# EAGLE design LS7366R_TestPRoject (EAGLE 7.5.0)
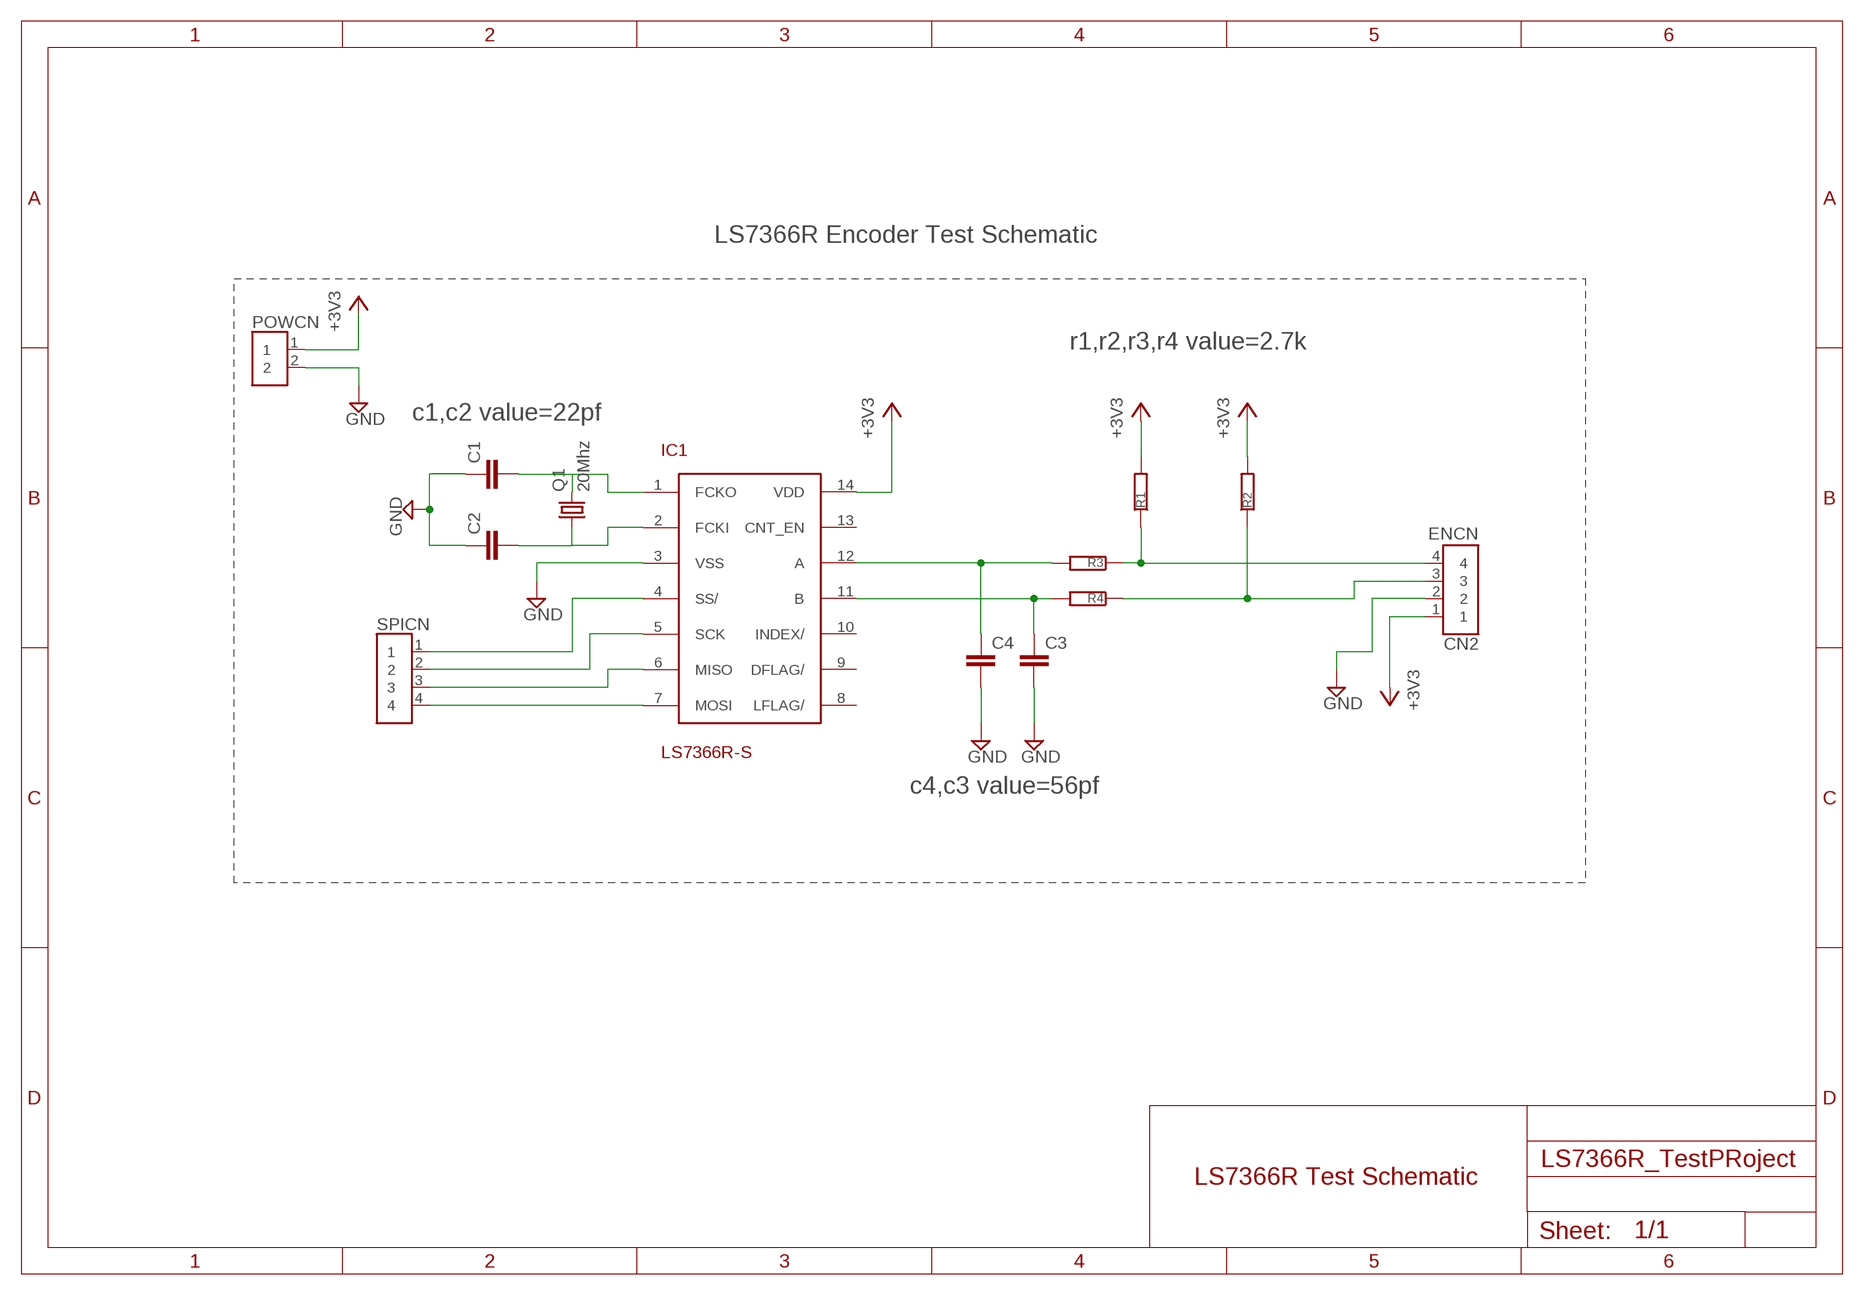
[diagram p0: schematic, sheet 1]

## Parts
C1  22pf  CHIP_CAPACITOR_0603  [L0_0603]
C2  22pf  CHIP_CAPACITOR_0603  [L0_0603]
C3  56pf  CHIP_CAPACITOR_0603  [L0_0603]
C4  56pf  CHIP_CAPACITOR_0603  [L0_0603]
CN2  ENCN  TUNIK-4PIN  [L0_TUNIK-4]
IC1  LS7366R-S  [SOIC-14]
POWCN  TUNIK-2PIN  [L0_TUNIK-2]
Q1  20Mhz  CRYSTAL_ABM3  [L0_ABM3]
R1  2.7k  CHIP_RESISTOR_0603  [L0_0603]
R2  2.7k  CHIP_RESISTOR_0603  [L0_0603]
R3  2.7k  CHIP_RESISTOR_0603  [L0_0603]
R4  2.7k  CHIP_RESISTOR_0603  [L0_0603]
SPICN  TUNIK-4PIN  [L0_TUNIK-4]

## Nets
+3V3: CN2.1 IC1.14(VDD) POWCN.1 R1.2 R2.2
GND: C1.2 C2.2 C3.1 C4.1 CN2.2 IC1.3(VSS) POWCN.2
N$1: CN2.4 R1.1 R3.1
N$2: CN2.3 R2.1 R4.1
N$3: C4.2 IC1.12(A) R3.2
N$4: C3.2 IC1.11(B) R4.2
N$5: C1.1 IC1.1(FCKO) Q1.2
N$6: C2.1 IC1.2(FCKI) Q1.1
N$9: IC1.4(SS/) SPICN.1
N$10: IC1.5(SCK) SPICN.2
N$11: IC1.6(MISO) SPICN.3
N$12: IC1.7(MOSI) SPICN.4
Unconnected: IC1.8(LFLAG/) IC1.9(DFLAG/) IC1.10(INDEX/) IC1.13(CNT_EN)

## Notes on the sheet
- LS7366R Encoder Test Schematic
- r1,r2,r3,r4 value=2.7k
- c1,c2 value=22pf
- c4,c3 value=56pf
- LS7366R Test Schematic

## Library data of the parts
C1-C4 = FINAL-JibPivot:CHIP_CAPACITOR: SMD Chip Capacitor
CN2 SPICN = FINAL-JibPivot:TUNIK-4PIN: TUNIK Connector
IC1 = smd-footprints:LS7366R-S
POWCN = 2axishead-Final:TUNIK-2PIN: TUNIK Connector
Q1 = FINAL-JibPivot:CRYSTAL_ABM3: SMD Crystal Miniature Ceramic SMD Crystal
R1-R4 = FINAL-JibPivot:CHIP_RESISTOR: SMD Chip Resistor

## Board
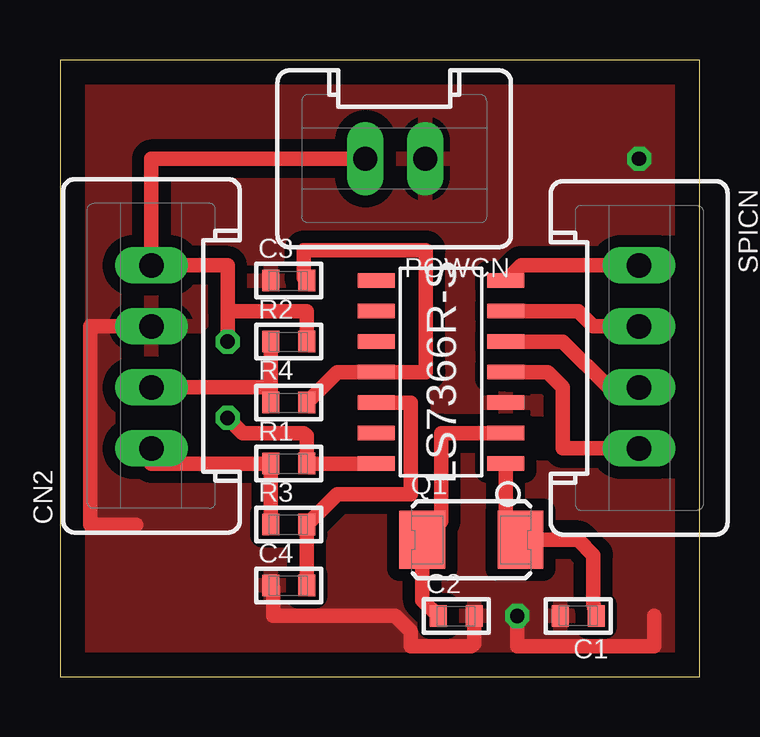
[diagram p1: board, top side]
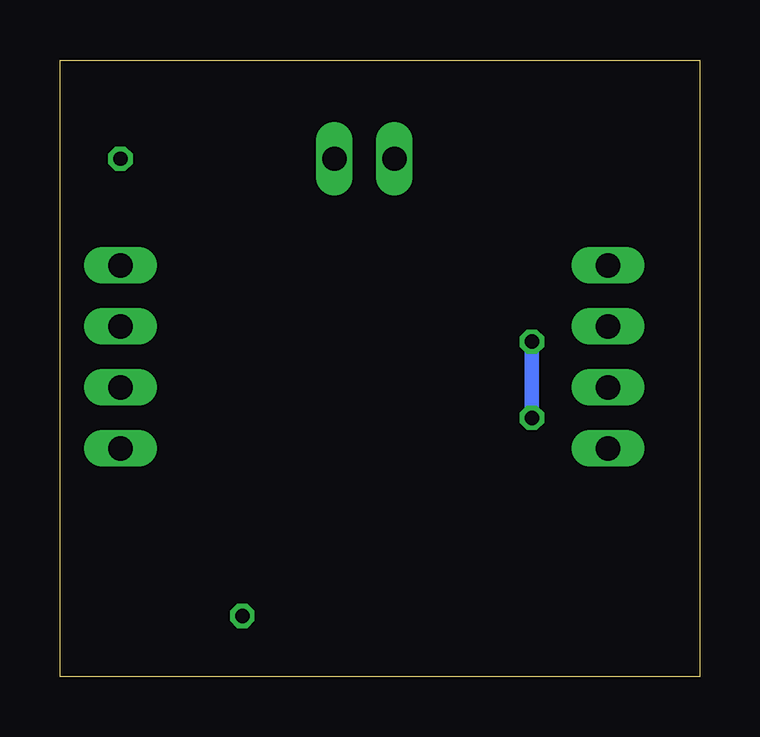
[diagram p2: board, bottom side, seen from below]

Size 26.65 x 25.71 mm. Coordinates in mm from the lower left corner, seen from the top.
Outline: 0,0 26.65,0 26.65,25.71 0,25.71 0,0
Copper layers (1*16): Top 0.035mm / dielectric 1.5mm / Bottom 0.035mm
Design rules "default": minimum track width 10mil, minimum drill 24mil, track to track 8mil, track to pad 8mil, pad to pad 8mil, via to via 8mil, smd to smd 8mil, copper to edge 40mil, drill to drill 8mil, minimum pad ring 10mil, minimum via ring 8mil, stop-mask expansion 4mil, vias tented up to drill 0mil, thermal gap 10mil

### Footprints (pad centres in the part's own frame; a part is rotated, then mirrored left to right if it is on the bottom)
L0_0603 = smd 0.7 x 0.9: 1 -0.75,0; 2 0.75,0
L0_TUNIK-4 = drill 1.016 long: 1 3.81,0; 2 1.27,0; 3 -1.27,0; 4 -3.81,0
SOIC-14 = smd 0.6 x 1.55: 1 -3.81,-2.7; 2 -2.54,-2.7; 3 -1.27,-2.7; 4 0,-2.7; 5 1.27,-2.7; 6 2.54,-2.7; 7 3.81,-2.7; 8 3.81,2.7; 9 2.54,2.7; 10 1.27,2.7; 11 0,2.7; 12 -1.27,2.7; 13 -2.54,2.7; 14 -3.81,2.7
L0_TUNIK-2 = drill 1.016 long: 1 1.25,0; 2 -1.25,0
L0_ABM3 = smd 1.9 x 2.4: 1 -2.05,0; 2 2.05,0

### Placement (x,y rotation side)
C1  21.59,2.54 180 top
C2  16.51,2.54 0 top
C3  9.53,16.51 0 top
C4  9.53,3.81 0 top
CN2  3.81,13.34 90 top
IC1  15.88,12.7 90 top
POWCN  13.97,21.59 180 top
Q1  17.14,5.71 0 top
R1  9.53,8.89 0 top
R2  9.53,13.97 0 top
R3  9.53,6.35 0 top
R4  9.53,11.43 0 top
SPICN  24.13,13.34 270 top

### Tracks (layer width: path | path; a pad name or v marks a point on that pad's centre or on a via)
+3V3  (via drill 0.6)
  Top 0.61: IC1.14 R1.2 10.27,10.04 10.16,10.16 7.62,10.16 v6.99,10.79 | R2.2 10.27,15.24 6.99,15.24 | 6.99,15.24 6.99,17.14 CN2.1 3.81,21.59 POWCN.1 | 6.99,15.24 v6.99,13.97
  Bottom 0.61: v6.99,10.79 v6.99,13.97
GND  (via drill 0.6)
  Top 0.61: CN2.2 1.27,14.61 1.27,6.35 3.17,6.35 | C4.1 8.89,3.69 8.89,2.54 13.97,2.54 14.6,1.9 14.6,1.27 17.14,1.27 17.26,1.38 C2.2 | v19.05,2.54 19.05,1.27 24.77,1.27 24.77,2.54
  other vias: 24.13,21.59
  pour Top (isolate 0.508): 0.64,25.4 26.67,25.4 26.67,0 0.64,0
N$1
  Top 0.61: R3.1 R1.1 3.81,8.89 CN2.4
N$2
  Top 0.61: R2.1 R4.1 8.78,12.07 CN2.3
N$3
  Top 0.61: C4.2 R3.2 11.54,7.62 14.6,7.62 14.6,11.43 IC1.12
N$4
  Top 0.61: R4.2 11.54,12.7 IC1.11 15.24,12.7 15.24,17.78 10.16,17.78 10.16,16.62 C3.2
N$5
  Top 0.61: IC1.1 18.58,6.33 Q1.2 21.59,5.71 22.23,5.08 22.23,3.06 C1.1
N$6
  Top 0.61: IC1.2 15.88,10.16 15.88,6.49 Q1.1 15.09,3.2 C2.1
N$9
  Top 0.61: IC1.4 20.32,12.7 20.96,12.07 20.96,9.52 SPICN.1
N$10
  Top 0.61: IC1.5 20.96,13.97 22.86,12.07 SPICN.2
N$11
  Top 0.61: IC1.6 21.59,15.24 22.23,14.61 SPICN.3
N$12
  Top 0.61: IC1.7 19.21,17.14 SPICN.4